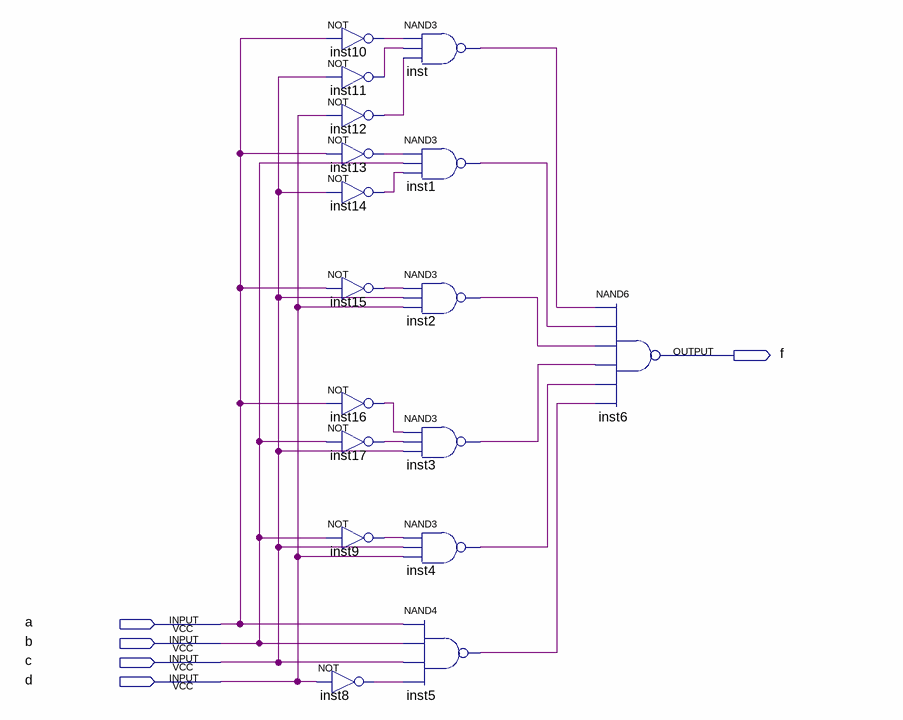
[diagram p0: schematic sheet]
// Quartus schematic nand.bdf as structural Verilog: 17 symbols, 5 pins
module \nand  (
  input  a,
  input  b,
  input  c,
  input  d,
  output f
);

  wire inst1_out, inst2_out, inst3_out, inst4_out, inst5_out, inst8_out, inst9_out, inst10_out, inst11_out,
       inst12_out, inst13_out, inst14_out, inst15_out, inst16_out, inst17_out, inst_out;

  not inst10 (inst10_out, a);
  not inst11 (inst11_out, c);
  not inst12 (inst12_out, d);
  not inst13 (inst13_out, a);
  not inst14 (inst14_out, c);
  not inst15 (inst15_out, a);
  not inst16 (inst16_out, a);
  not inst17 (inst17_out, b);
  not inst9 (inst9_out, b);
  not inst8 (inst8_out, d);
  nand inst (inst_out, inst10_out, inst11_out, inst12_out);
  nand inst1 (inst1_out, inst13_out, b, inst14_out);
  nand inst2 (inst2_out, inst15_out, c, d);
  nand inst3 (inst3_out, inst16_out, inst17_out, c);
  nand inst4 (inst4_out, inst9_out, c, d);
  nand inst5 (inst5_out, a, b, c, inst8_out);
  nand inst6 (f, inst_out, inst1_out, inst2_out, inst3_out, inst4_out, inst5_out);
endmodule
